# EAGLE design wearable_base (EAGLE 6.6.0)
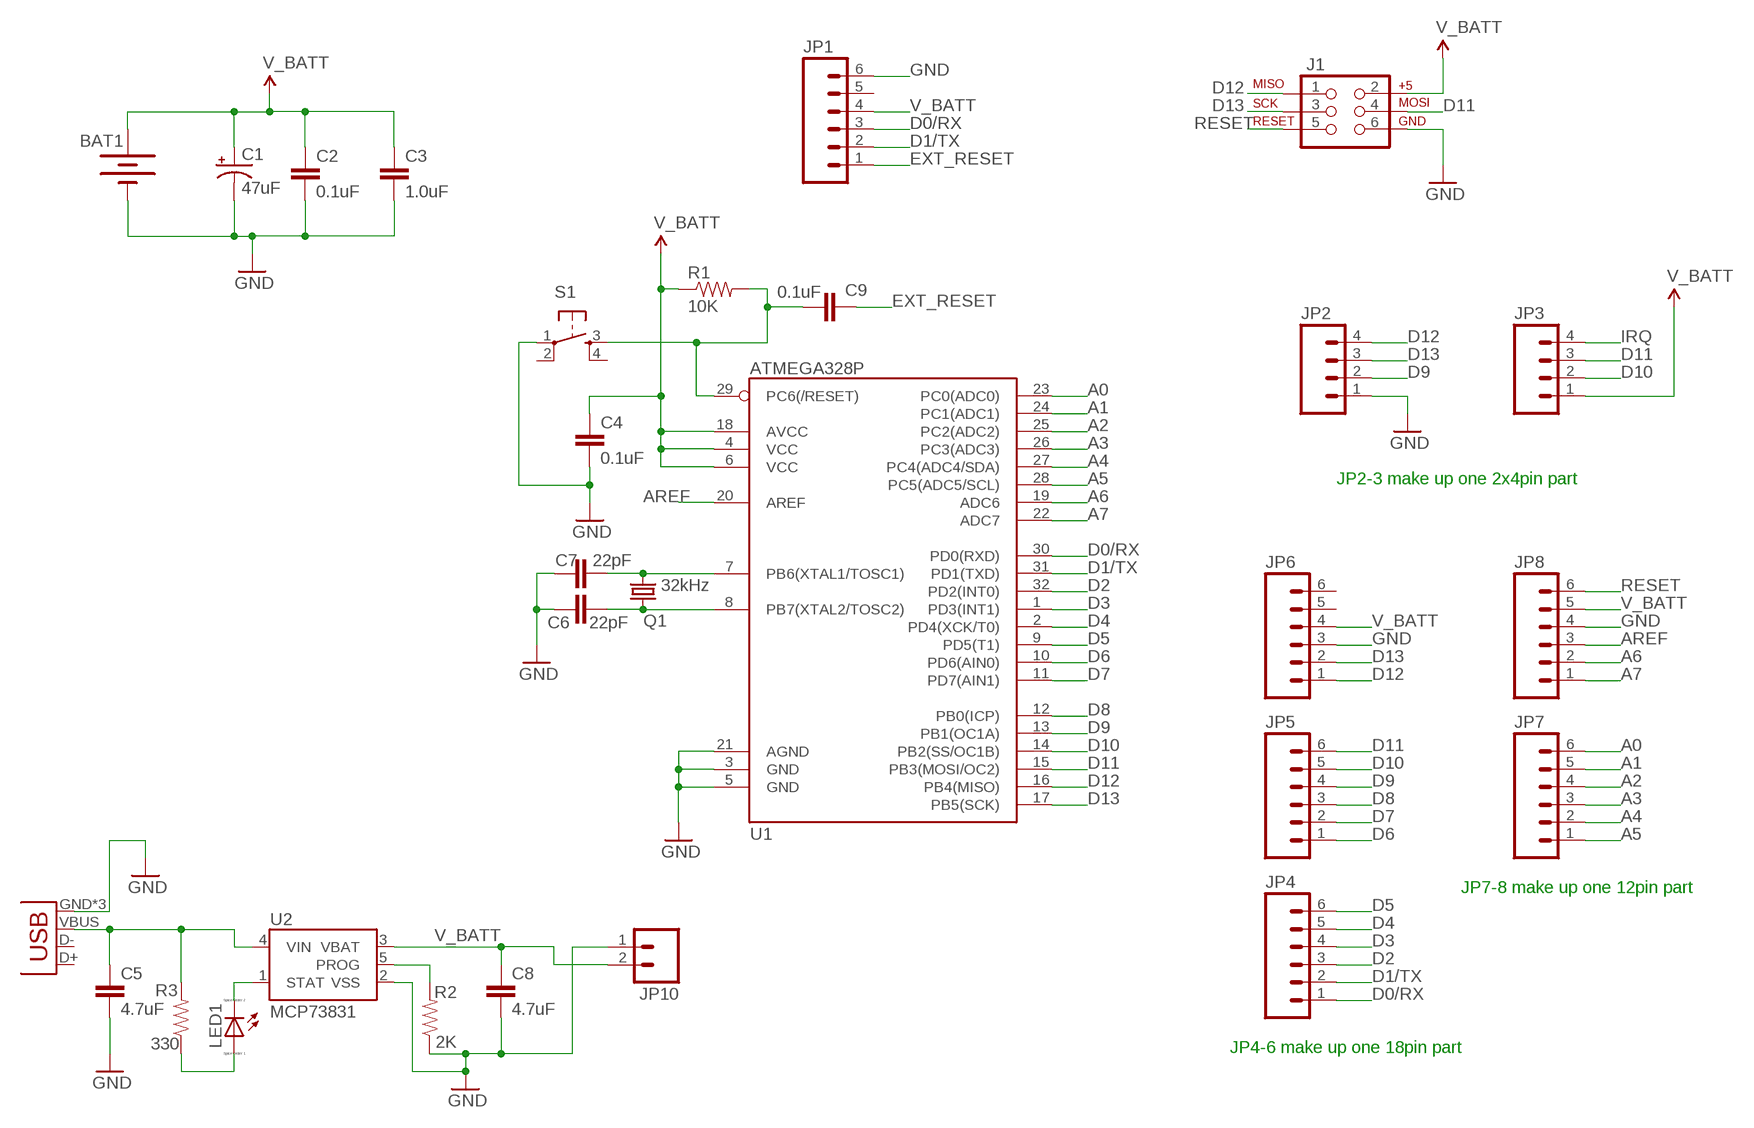
[diagram p0: schematic, sheet 1]

## Parts
BAT1  20mm coincell  BATTERY20MM_4LEGS  [BATTCON_20MM_4LEGS]
C1  47uF  CAP_POL1206  [EIA3216]
C2  0.1uF  0.1UF-25V-5%(0603)  [0603-CAP]
C3  1.0uF  1.0UF-16V-10%(0603)  [0603-CAP]
C4  0.1uF  0.1UF-25V-5%(0603)  [0603-CAP]
C5  4.7uF  CAP0603-CAP  [0603-CAP]
C6  22pF  22PF-50V-5%(0603)  [0603-CAP]
C7  22pF  22PF-50V-5%(0603)  [0603-CAP]
C8  4.7uF  CAP0603-CAP  [0603-CAP]
C9  0.1uF  0.1UF-25V-5%(0603)  [0603-CAP]
J1  AVR_SPI_PRG_6PTH  [2X3]
JP1  M06SIP  [1X06]
JP2  M04PTH  [1X04]
JP3  M04PTH  [1X04]
JP4  M06SIP  [1X06]
JP5  M06SIP  [1X06]
JP6  M06SIP  [1X06]
JP7  M06SIP  [1X06]
JP8  M06SIP  [1X06]
JP9  USB-MICROB  [USB-MICROB]
JP10  M02JST-PTH-2  [JST-2-PTH]
LED1  LED_ESML0603  [LED_SML0603]
Q1  32kHz  CRYSTALTC26H  [TC26H]
R1  10K  RESISTOR0603-RES  [0603-RES]
R2  2K  RESISTOR0603-RES  [0603-RES]
R3  330  RESISTOR0603-RES  [0603-RES]
S1  TAC_SWITCHSMD  [TACTILE_SWITCH_SMD]
U1  ATMEGA328P  ATMEGA328_SMT  [TQFP32-08]
U2  MCP73831  [SOT23-5]

## Nets
A0: JP7.6 U1.23(PC0(ADC0))
A1: JP7.5 U1.24(PC1(ADC1))
A2: JP7.4 U1.25(PC2(ADC2))
A3: JP7.3 U1.26(PC3(ADC3))
A4: JP7.2 U1.27(PC4(ADC4/SDA))
A5: JP7.1 U1.28(PC5(ADC5/SCL))
A6: JP8.2 U1.19(ADC6)
A7: JP8.1 U1.22(ADC7)
AREF: JP8.3 U1.20(AREF)
D0/RX: JP1.3 JP4.1 U1.30(PD0(RXD))
D1/TX: JP1.2 JP4.2 U1.31(PD1(TXD))
D2: JP4.3 U1.32(PD2(INT0))
D3: JP4.4 U1.1(PD3(INT1))
D4: JP4.5 U1.2(PD4(XCK/T0))
D5: JP4.6 U1.9(PD5(T1))
D6: JP5.1 U1.10(PD6(AIN0))
D7: JP5.2 U1.11(PD7(AIN1))
D8: JP5.3 U1.12(PB0(ICP))
D9: JP2.2 JP5.4 U1.13(PB1(OC1A))
D10: JP3.2 JP5.5 U1.14(PB2(SS/OC1B))
D11: J1.4 JP3.3 JP5.6 U1.15(PB3(MOSI/OC2))
D12: J1.1 JP2.4 JP6.1 U1.16(PB4(MISO))
D13: J1.3 JP2.3 JP6.2 U1.17(PB5(SCK))
EXT_RESET: C9.1 JP1.1
GND: BAT1.2(-) C1.C(-) C2.2 C3.2 C4.2 C5.2 C6.1 C7.2 C8.2 J1.6 JP1.6 JP2.1 JP6.3 JP8.4 JP9.GND JP9.MT1(GND) JP9.MT2(GND) JP10.1 R2.1 S1.1 U1.3(GND) U1.5(GND) U1.21(AGND) U2.2(VSS)
IRQ: JP3.4
N$1: C7.1 Q1.2 U1.7(PB6(XTAL1/TOSC1))
N$2: C6.2 Q1.1 U1.8(PB7(XTAL2/TOSC2))
N$4: LED1.C U2.1(STAT)
N$7: LED1.A R3.1
N$8: C5.1 JP9.VBUS R3.2 U2.4(VIN)
N$13: R2.2 U2.5(PROG)
RESET: C9.2 J1.5 JP8.6 R1.2 S1.3 U1.29(PC6(/RESET))
V_BATT: BAT1.1(+) C1.A(+) C2.1 C3.1 C4.1 C8.1 J1.2 JP1.4 JP3.1 JP6.4 JP8.5 JP10.2 R1.1 U1.4(VCC) U1.6(VCC) U1.18(AVCC) U2.3(VBAT)
Unconnected: JP1.5 JP6.5 JP6.6 JP9.D+ JP9.D- S1.2 S1.4

## Notes on the sheet
- JP2-3 make up one 2x4pin part
- JP7-8 make up one 12pin part
- JP4-6 make up one 18pin part

## Library data of the parts
BAT1 = SparkFun-Electromechanical:BATTERY: Battery Holders Various common sizes : AA, AAA, 20mm coin cell and 12mm coin cell. 20MM_4LEGS, BATT-10373; PROD_ID: BATT-10373
C1 = SparkFun-Capacitors:CAP_POL: Capacitor Polarized These are standard SMD and PTH capacitors. Normally 10uF, 47uF, and 100uF in electrolytic and tantalum varieties. Always verify the external diameter of the through hole cap, it varies with capacity, voltage, and manufacturer. The EIA devices should be standard.
C2 C4 C9 = SparkFun-Capacitors:0.1UF-25V-5%(0603): CAP-08604; PROD_ID: CAP-08604
C3 = SparkFun-Capacitors:1.0UF-16V-10%(0603): CAP-00868; PROD_ID: CAP-00868
C5 C8 = SparkFun-Passives:CAP: Capacitor Standard 0603 ceramic capacitor, and 0.1" leaded capacitor.
C6 C7 = SparkFun-Capacitors:22PF-50V-5%(0603): CAP-07876; PROD_ID: CAP-07876
J1 = SparkFun-Connectors:AVR_SPI_PRG_6: AVR ISP 6 Pin This is the reduced ISP connector for AVR programming. Common on Arduino. This footprint will take up less PCB space and can be used with a 10-pin to 6-pin adapter such as SKU: BOB-08508
JP1 JP4-JP8 = SparkFun-Connectors:M06: Header 6 Standard 6-pin 0.1" header. Use with straight break away headers (SKU : PRT-00116), right angle break away headers (PRT-00553), swiss pins (PRT-00743), machine pins (PRT-00117), and female headers (PRT-00115). Molex polarized connector foot print use with SKU : PRT-08094 with associated crimp pins and housings. NOTES ON THE VARIANTS LOCK and LOCK_LONGPADS... This footprint was designed to help hold the alignment of a through-hole component (i.e. 6-pin header) while soldering it into place. You may notice that each hole has been shifted either up or down by 0.005 of an inch from it's more standard position (which is a perfectly straight line). This slight alteration caused the pins (the squares in the middle) to touch the edges of the holes. Because they are alternating, it causes a "brace" to hold the component in place. 0.005 has proven to be the perfect amount of "off-center" position when using our standard breakaway headers. Although looks a little odd when you look at the bare footprint, once you have a header in there, the alteration is very hard to notice. Also,if you push a header all the way into place, it is covered up entirely on the bottom side. This idea of altering the position of holes to aid alignment will be further integrated into the Sparkfun Library for other footprints. It can help hold any component with 3 or more connection pins.
JP2 JP3 = SparkFun-Connectors:M04: Header 4 Standard 4-pin 0.1" header. Use with straight break away headers (SKU : PRT-00116), right angle break away headers (PRT-00553), swiss pins (PRT-00743), machine pins (PRT-00117), and female headers (PRT-00115). Molex polarized connector foot print use with SKU : PRT-08231 with associated crimp pins and housings. 1MM SMD Version SKU: PRT-10208
JP9 = SparkFun-Connectors:USB: USB Connectors USB-B-PTH is fully proven SKU : PRT-00139/CONN-08278 USB-miniB is fully proven SKU : PRT-00587 USB-A-PCB is untested. USB-A-H is throughly reviewed, but untested. Spark Fun Electronics SKU : PRT-00437 USB-B-SMT is throughly reviewed, but untested. Needs silkscreen touching up. USB-A-S has not been used/tested USB-MB-H has not been used/tested USB-MICROB has been used. CONN-09505; PROD_ID: CONN-09505
JP10 = SparkFun-Connectors:M02: Standard 2-pin 0.1" header. Use with - straight break away headers ( PRT-00116) - right angle break away headers (PRT-00553) - swiss pins (PRT-00743) - machine pins (PRT-00117) - female headers (PRT-00115) Molex polarized connector foot print use with: PRT-08233 with associated crimp pins and housings. 2.54_SCREWTERM for use with PRT-10571. 3.5mm Screw Terminal footprints for PRT-08084 5mm Screw Terminal footprints for use with PRT-08433; SKU: PRT-09914
LED1 = eagle-ltspice:LED_E: LED Source: http://www.osram.convergy.de Source: www.luxeon.com Source: www.kingbright.com; SPICEMODEL: NONE; SPICEPREFIX: D; SPICETYPE: diode
Q1 = crystal:CRYSTAL: CRYSTAL; OC_FARNELL: unknown; OC_NEWARK: unknown
R1-R3 = SparkFun-Passives:RESISTOR: Resistor Basic schematic elements and footprints for 0603, 1206, and PTH resistors.
S1 = SparkFun-Electromechanical:TAC_SWITCH: Momentary Switch Button commonly used for reset or general input. Spark Fun Electronics SKU : COM-00097 SMT- SWCH-08247; PROD_ID: SWCH-08247
U1 = SparkFun-DigitalIC:ATMEGA328_SMT: 32-Pin Atmega328 part Commonly used on Arduino compatible boards Available in QFP and QFN packages TQFP is IC-09069 QFN is non-stock; PROD_ID: IC-09069
U2 = SparkFun-PowerIC:MCP73831: Miniature single cell, fully integrated Li-Ion, Li-polymer charge management controller http://ww1.microchip.com/downloads/en/DeviceDoc/21984a.pdf IC-09995; PROD_ID: IC-09995

## Board
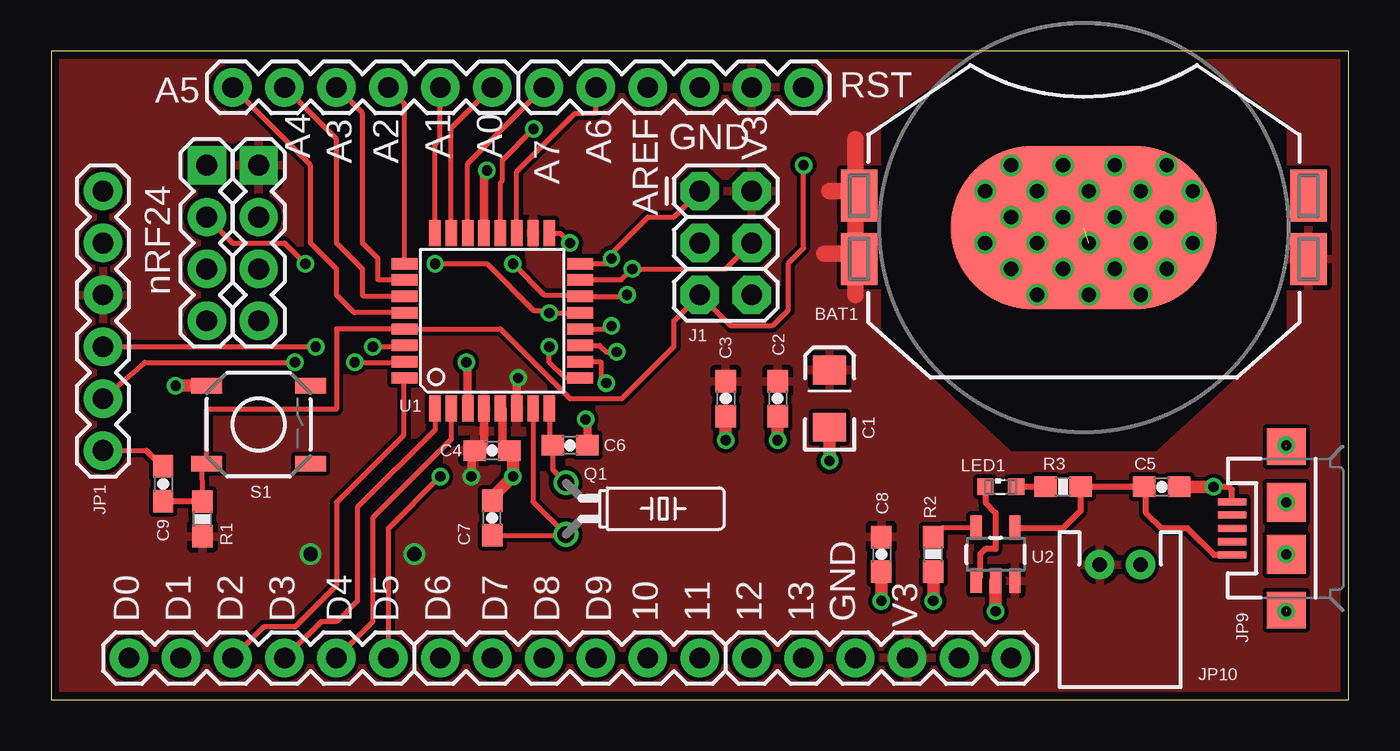
[diagram p1: board, top side]
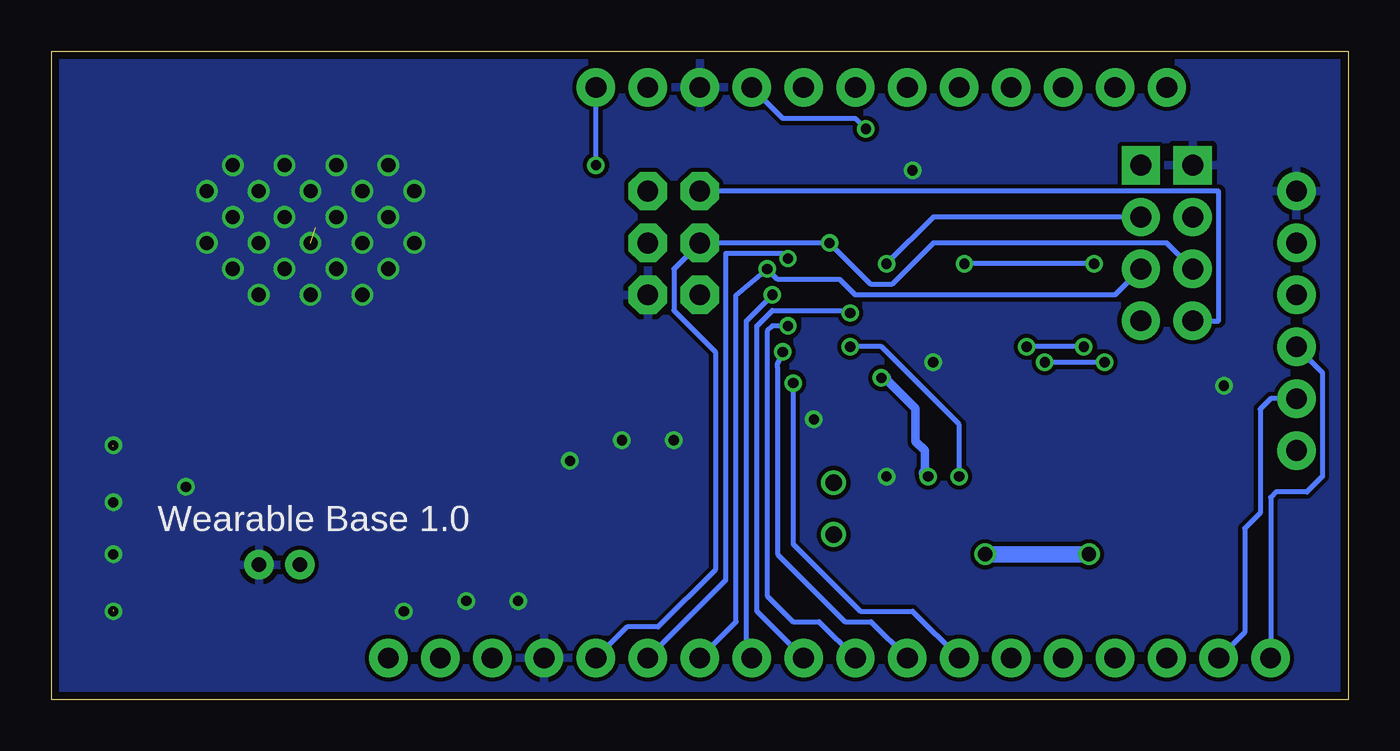
[diagram p2: board, bottom side, seen from below]

Size 63.5 x 31.75 mm. Coordinates in mm from the lower left corner, seen from the top.
Outline: 63.5,31.75 63.5,0 0,0 0,31.75 63.5,31.75
Copper layers (1*16): Top 0.0356mm / dielectric 1.5011mm / Bottom 0.0356mm
Design rules "LaenPCBOrder *": minimum track width 6mil, minimum drill 13mil, track to track 8mil, track to pad 8mil, pad to pad 8mil, via to via 8mil, smd to smd 8mil, copper to edge 15mil, drill to drill 6mil, minimum pad ring 7mil, minimum via ring 7mil, stop-mask expansion 3mil, vias tented up to drill 0mil, thermal gap 10mil
tRestrict: 17 lines

### Footprints (pad centres in the part's own frame; a part is rotated, then mirrored left to right if it is on the bottom)
BATTCON_20MM_4LEGS = smd 1.778 x 2.54: 1 -11,1.55; 3 11,1.55; P$1 -11,-1.55; P$2 11,-1.55 | smd 13 x 8: 2 0,0
EIA3216 = smd 1.4 x 1.6: A 1.4,0; C -1.4,0
0603-CAP = smd 1.1 x 1: 1 -0.85,0; 2 0.85,0
2X3 = drill 1.016 pad 1.88 octagon: 1 0,0; 2 0,2.54; 3 2.54,0; 4 2.54,2.54; 5 5.08,0; 6 5.08,2.54
1X06 = drill 1.016 pad 1.88: 1 0,0; 2 2.54,0; 3 5.08,0; 4 7.62,0; 5 10.16,0; 6 12.7,0
1X04 = drill 1.016 pad 1.88 square: 1 0,0 | drill 1.016 pad 1.88: 2 2.54,0; 3 5.08,0; 4 7.62,0
USB-MICROB = smd 0.35 x 1.4: D+ 0,2.65; D- -0.65,2.65; GND 1.3,2.65; ID 0.65,2.65; VBUS -1.3,2.65 | smd 1.8 x 1.9: MT1 -4,0; MT2 4,0 | smd 1.9 x 1.9: P$1 -1.27,0; P$2 1.27,0
JST-2-PTH = drill 0.7 pad 1.448: 1 -1,0; 2 1,0
LED_SML0603 = smd 0.8 x 0.8: A 0.75,0; C -0.75,0
TC26H = drill 0.813: 1 -1.27,0; 2 1.27,0
0603-RES = smd 1.1 x 1: 1 -0.85,0; 2 0.85,0
TACTILE_SWITCH_SMD = smd 1.524 x 0.762: 1 -2.54,1.905; 2 2.54,1.905; 3 -2.54,-1.905; 4 2.54,-1.905
TQFP32-08 = smd 1.27 x 0.559: 1 -4.293,2.8; 2 -4.293,2; 3 -4.293,1.2; 4 -4.293,0.4; 5 -4.293,-0.4; 6 -4.293,-1.2; 7 -4.293,-2; 8 -4.293,-2.8; 17 4.293,-2.8; 18 4.293,-2; 19 4.293,-1.2; 20 4.293,-0.4; 21 4.293,0.4; 22 4.293,1.2; 23 4.293,2; 24 4.293,2.8 | smd 0.559 x 1.27: 9 -2.8,-4.293; 10 -2,-4.293; 11 -1.2,-4.293; 12 -0.4,-4.293; 13 0.4,-4.293; 14 1.2,-4.293; 15 2,-4.293; 16 2.8,-4.293; 25 2.8,4.293; 26 2,4.293; 27 1.2,4.293; 28 0.4,4.293; 29 -0.4,4.293; 30 -1.2,4.293; 31 -2,4.293; 32 -2.8,4.293
SOT23-5 = smd 0.55 x 1.2: 1 -0.95,-1.3; 2 0,-1.3; 3 0.95,-1.3; 4 0.95,1.3; 5 -0.95,1.3

### Placement (x,y rotation side)
BAT1  50.55,23.11 180 top
C1  38.1,14.73 90 top
C2  35.56,14.73 270 top
C3  33.02,14.73 270 top
C4  21.59,12.19 0 top
C5  54.36,10.41 0 top
C6  25.4,12.45 180 top
C7  21.59,8.89 90 top
C8  40.64,7.11 270 top
C9  5.49,10.57 270 top
J1  31.75,24.89 270 top
JP1  2.54,12.19 90 top
JP2  7.62,26.16 270 top
JP3  10.16,26.16 270 top
JP4  3.81,2.03 0 top
JP5  19.05,2.03 0 top
JP6  34.29,2.03 0 top
JP7  8.89,29.97 0 top
JP8  24.13,29.97 0 top
JP9  60.45,8.38 90 top
JP10  52.32,6.6 180 top
LED1  46.48,10.41 0 top
Q1  25.2,9.35 270 top
R1  7.42,8.84 90 top
R2  43.18,7.11 90 top
R3  49.53,10.41 0 top
S1  10.16,13.46 0 top
U1  21.59,18.54 90 top
U2  46.23,7.11 0 top

### Tracks (layer width: path | path; a pad name or v marks a point on that pad's centre or on a via)
A0
  Top 0.254: U1.23 19.59,27.97 JP7.6
A1
  Top 0.254: U1.24 18.79,27.17 19.05,27.43 JP7.5
A2
  Top 0.254: U1.25 17.3,29.19 JP7.4
A3
  Top 0.254: U1.26 16.03,20.54 16,20.57 16,21.59 15.24,22.35 15.24,28.7 JP7.3
A4
  Top 0.254: U1.27 15.31,19.74 15.24,19.81 15.24,21.08 13.97,22.35 13.97,27.43 JP7.2
A5
  Top 0.254: U1.28 14.84,18.94 13.97,19.81 13.97,21.08 12.7,22.35 12.7,26.16 JP7.1
A6
  Top 0.254: U1.19 22.79,25.84 25.65,28.7 26.67,28.7 JP8.2
A7
  Top 0.254: U1.22 20.39,26.23 JP8.1
AREF  (via drill 0.5 pad 0.41)
  Top 0.254: U1.20 21.99,25.29 22.1,25.4 22.1,26.42 v23.62,27.94
  Bottom 0.254: v23.62,27.94 24.13,28.45 27.69,28.45 JP8.3
D0/RX  (via drill 0.5, 0.5 pad 0.25)
  Top 0.254: JP1.3 v12.95,17.27 | v15.75,17.27 17.78,17.27
  Top 0.305: 17.78,17.27 U1.30
  Bottom 0.254: v12.95,17.27 v15.75,17.27 | JP1.3 1.27,16 1.27,10.92 2.03,10.16 3.56,10.16 3.81,9.91 JP4.1
D1/TX  (via drill 0.5 pad 0.25)
  Top 0.254: JP1.2 4.57,16.51 v11.94,16.51 | v14.86,16.51 17.27,16.51 U1.31
  Bottom 0.254: v11.94,16.51 v14.86,16.51 | JP1.2 3.81,14.73 4.32,14.22 4.32,9.14 5.08,8.38 5.08,3.3 JP4.2
D2
  Top 0.254: U1.32 17.27,15.72 17.27,12.95 13.97,9.65 13.97,5.59 11.94,3.56 10.41,3.56 JP4.3
D3
  Top 0.254: U1.1 18.79,13.2 14.99,9.4 14.99,4.83 13.97,3.81 13.21,3.81 JP4.4
D4
  Top 0.254: U1.2 19.59,12.73 15.75,8.89 15.75,3.81 JP4.5
D5  (via drill 0.5 pad 0.25)
  Top 0.254: U1.9 25.15,15.74 24.38,16.51 v24.38,17.27 | JP4.6 16.51,8.38 v19.05,10.92
  Bottom 0.254: v19.05,10.92 19.05,13.46 22.86,17.27 v24.38,17.27
D6  (via drill 0.5 pad 0.25)
  Top 0.254: U1.10 26.89,16.54 26.92,16.51 26.92,15.75 v27.18,15.49
  Bottom 0.254: v27.18,15.49 27.18,7.62 23.88,4.32 21.34,4.32 JP5.1
D7  (via drill 0.5 pad 0.25)
  Top 0.254: U1.11 26.85,17.34 27.18,17.02 v27.69,17.02
  Bottom 0.254: v27.69,17.02 27.94,16.46 27.94,16.26 27.94,7.11 24.64,3.81 23.37,3.81 JP5.2
D8  (via drill 0.5 pad 0.25)
  Top 0.254: U1.12 27.03,18.14 v27.43,18.29
  Bottom 0.254: v27.43,18.29 28.19,18.29 28.45,18.03 28.45,5.08 27.18,3.81 25.91,3.81 JP5.3
D9  (via drill 0.5 pad 0.25, 0.5 pad 0.33)
  Top 0.254: JP2.2 8.89,22.35 11.43,22.35 v12.45,21.34 | U1.13 25.86,18.92 v24.38,18.92 24.26,19.05 23.62,19.05 21.34,21.34 v18.8,21.34
  Bottom 0.254: v12.45,21.34 v18.8,21.34 | v24.38,18.92 24.51,19.05 28.19,19.05 28.96,18.29 28.96,4.32 JP5.4
D10  (via drill 0.5, 0.5 pad 0.25)
  Top 0.254: v22.61,21.34 24.13,19.81 25.4,19.81 U1.14 28.01,19.74 v28.19,19.81
  Bottom 0.254: v22.61,21.34 20.32,23.62 JP3.2 | v28.19,19.81 29.46,18.54 29.46,2.29 JP5.5
D11  (via drill 0.5 pad 0.25)
  Top 0.254: J1.4 33.02,21.08 v28.45,21.08 27.91,20.54 U1.15
  Bottom 0.254: JP3.3 11.43,19.81 24.13,19.81 24.89,20.57 27.94,20.57 v28.45,21.08 29.97,19.81 29.97,3.81 JP5.6
D12  (via drill 0.5 pad 0.25)
  Top 0.254: U1.16 27.18,21.34 v27.43,21.59 27.43,21.84 29.21,23.62 30.48,23.62 J1.1
  Bottom 0.254: JP2.4 6.35,18.54 6.35,24.89 J1.1 | v27.43,21.59 27.69,21.84 30.48,21.84 30.48,5.84 JP6.1
D13  (via drill 0.5 pad 0.25)
  Top 0.254: U1.17 24.92,22.84 v25.4,22.35
  Bottom 0.254: JP2.3 8.89,22.35 20.32,22.35 22.35,20.32 23.37,20.32 v25.4,22.35 J1.3 33.02,21.08 33.02,19.05 30.99,17.02 30.99,6.35 33.78,3.56 35.31,3.56 JP6.2
EXT_RESET
  Top 0.254: JP1.1 4.66,12.19
  Top 0.305: C9.1 5.49,11.38 5.47,11.38 4.66,12.19
GND  (via drill 0.5, 0.5 pad 0.25, 0.5 pad 0.33, 0.7 pad 0.81)  (3 unrouted)
  Top 0.254: U1.5 22.1,14.25 | 22.61,12.03 C4.2 | C7.2 21.59,9.91
  Top 0.305: JP9.GND 57.8,10.27 57.66,10.41 v56.9,10.41
  Top 0.406: 22.1,14.25 22.1,12.45 22.44,12.45 C4.2 | U1.21 21.19,25.51 v21.34,25.91 | C6.1 26.25,13.63 v26.16,13.72 | U1.3 20.39,16.44 v20.32,16.51
  Top 0.61: S1.1 v6.1,15.37 | 22.61,12.03 v22.61,10.92 21.59,9.91 | C3.2 v33.02,12.7 | C2.2 v35.56,12.7 | C1.C v38.1,11.68 | C8.2 v40.64,4.83 | R2.1 v43.18,4.83 | v46.23,4.32 U2.2 | C5.2 v56.9,10.41
  other vias: 45.72,24.89 46.99,26.16 49.53,26.16 48.26,24.89 46.99,23.62 45.72,22.35 46.99,21.08 48.26,22.35 52.07,26.16 54.61,26.16 55.88,24.89 54.61,23.62 53.34,24.89 55.88,22.35 54.61,21.08 53.34,22.35 52.07,21.08 53.34,19.81 50.8,19.81 48.26,19.81 49.53,21.08 50.8,22.35 52.07,23.62 50.8,24.89 49.53,23.62 60.45,12.45 60.45,9.65 60.45,7.11 60.45,4.32
  pour Bottom: 0.51,31.24 62.99,31.24 62.99,0.51 0.51,0.51
N$1
  Top 0.254: U1.7 23.59,9.68 Q1.2 25.16,8.04 C7.1
N$2
  Top 0.254: U1.8 24.39,12.61 C6.2 24.55,11.26 Q1.1
N$4
  Top 0.305: LED1.C 45.73,9.64 46.23,9.14 46.23,7.37 45.72,7.37 45.47,7.11 45.47,6 U2.1
N$7
  Top 0.305: R3.1 LED1.A
N$8
  Top 0.305: U2.4 47.21,8.38 49.53,8.38 50.38,9.23 R3.2 C5.1 53.59,10.33 53.59,9.14 54.36,8.38 55.63,8.38 56.93,7.08 JP9.VBUS
N$13
  Top 0.254: U2.5 43.63,8.41 R2.2
RESET  (via drill 0.5 pad 0.41)
  Top 0.254: R1.2 7.41,11.77 S1.3 7.62,14.22 13.97,14.22 13.97,18.14 U1.29 21.99,18.14 25.4,14.73 27.94,14.73 30.48,17.27 30.48,18.54 J1.5 33.27,18.29 35.31,18.29 36.07,19.05 36.07,21.34 36.83,22.1 v36.83,26.16
  Top 0.305: C9.2 7.39,9.72 R1.2
  Bottom 0.254: v36.83,26.16 JP8.6
V_BATT  (via drill 0.5 pad 0.25, 0.5 pad 0.41, 0.7 pad 0.81)
  Top 0.254: 20.57,12.03 C4.1
  Top 0.406: C4.1 21.19,12.19 U1.4 | U1.6 22.79,15.68 | v20.57,10.92 20.57,12.03
  Top 0.61: 22.79,15.68 v22.86,15.75
  Top 0.813: 37.85,21.84 39.37,21.84 | 39.62,21.84 39.37,21.84 | 39.37,21.84 39.37,19.81 | 39.37,27.43 39.37,24.89 | 39.37,24.89 38.1,24.89 | 39.37,24.89 39.37,22.35
  Bottom 0.406: 22.69,15.75 U1.4 21.19,12.64 C4.1 20.74,11.09
  Bottom 0.61: v22.86,15.75 22.69,15.75 | 20.74,11.09 v20.57,10.92
  Bottom 0.813: v12.7,7.11 v17.78,7.11
  pour Top: 0.51,31.24 62.99,31.24 62.99,0.51 0.51,0.51

### Text on the board
tNames: RST | A5 | A4 | A3 | A2 | A1 | A0 | A6 | AREF | A7 | GND | V3 | nRF24 | J1 | U1 | JP1 | D0 | D1 | D2 | D3 | D4 | D5 | D6 | D7 | D8 | D9 | 10 | 11 | 12 | 13 | GND | V3
bNames: Wearable Base 1.0